# Altium schematic sheet pca10156_sheet6_power_supply.SchDoc: =BoardTitle+' - Power Supply'
size A3; Organization: Nordic Semiconductor; DocumentNumber: 6; SheetNumber: 6; SheetTotal: 8; CompanyName: Nordic Semiconductor; DocumentSize: A4
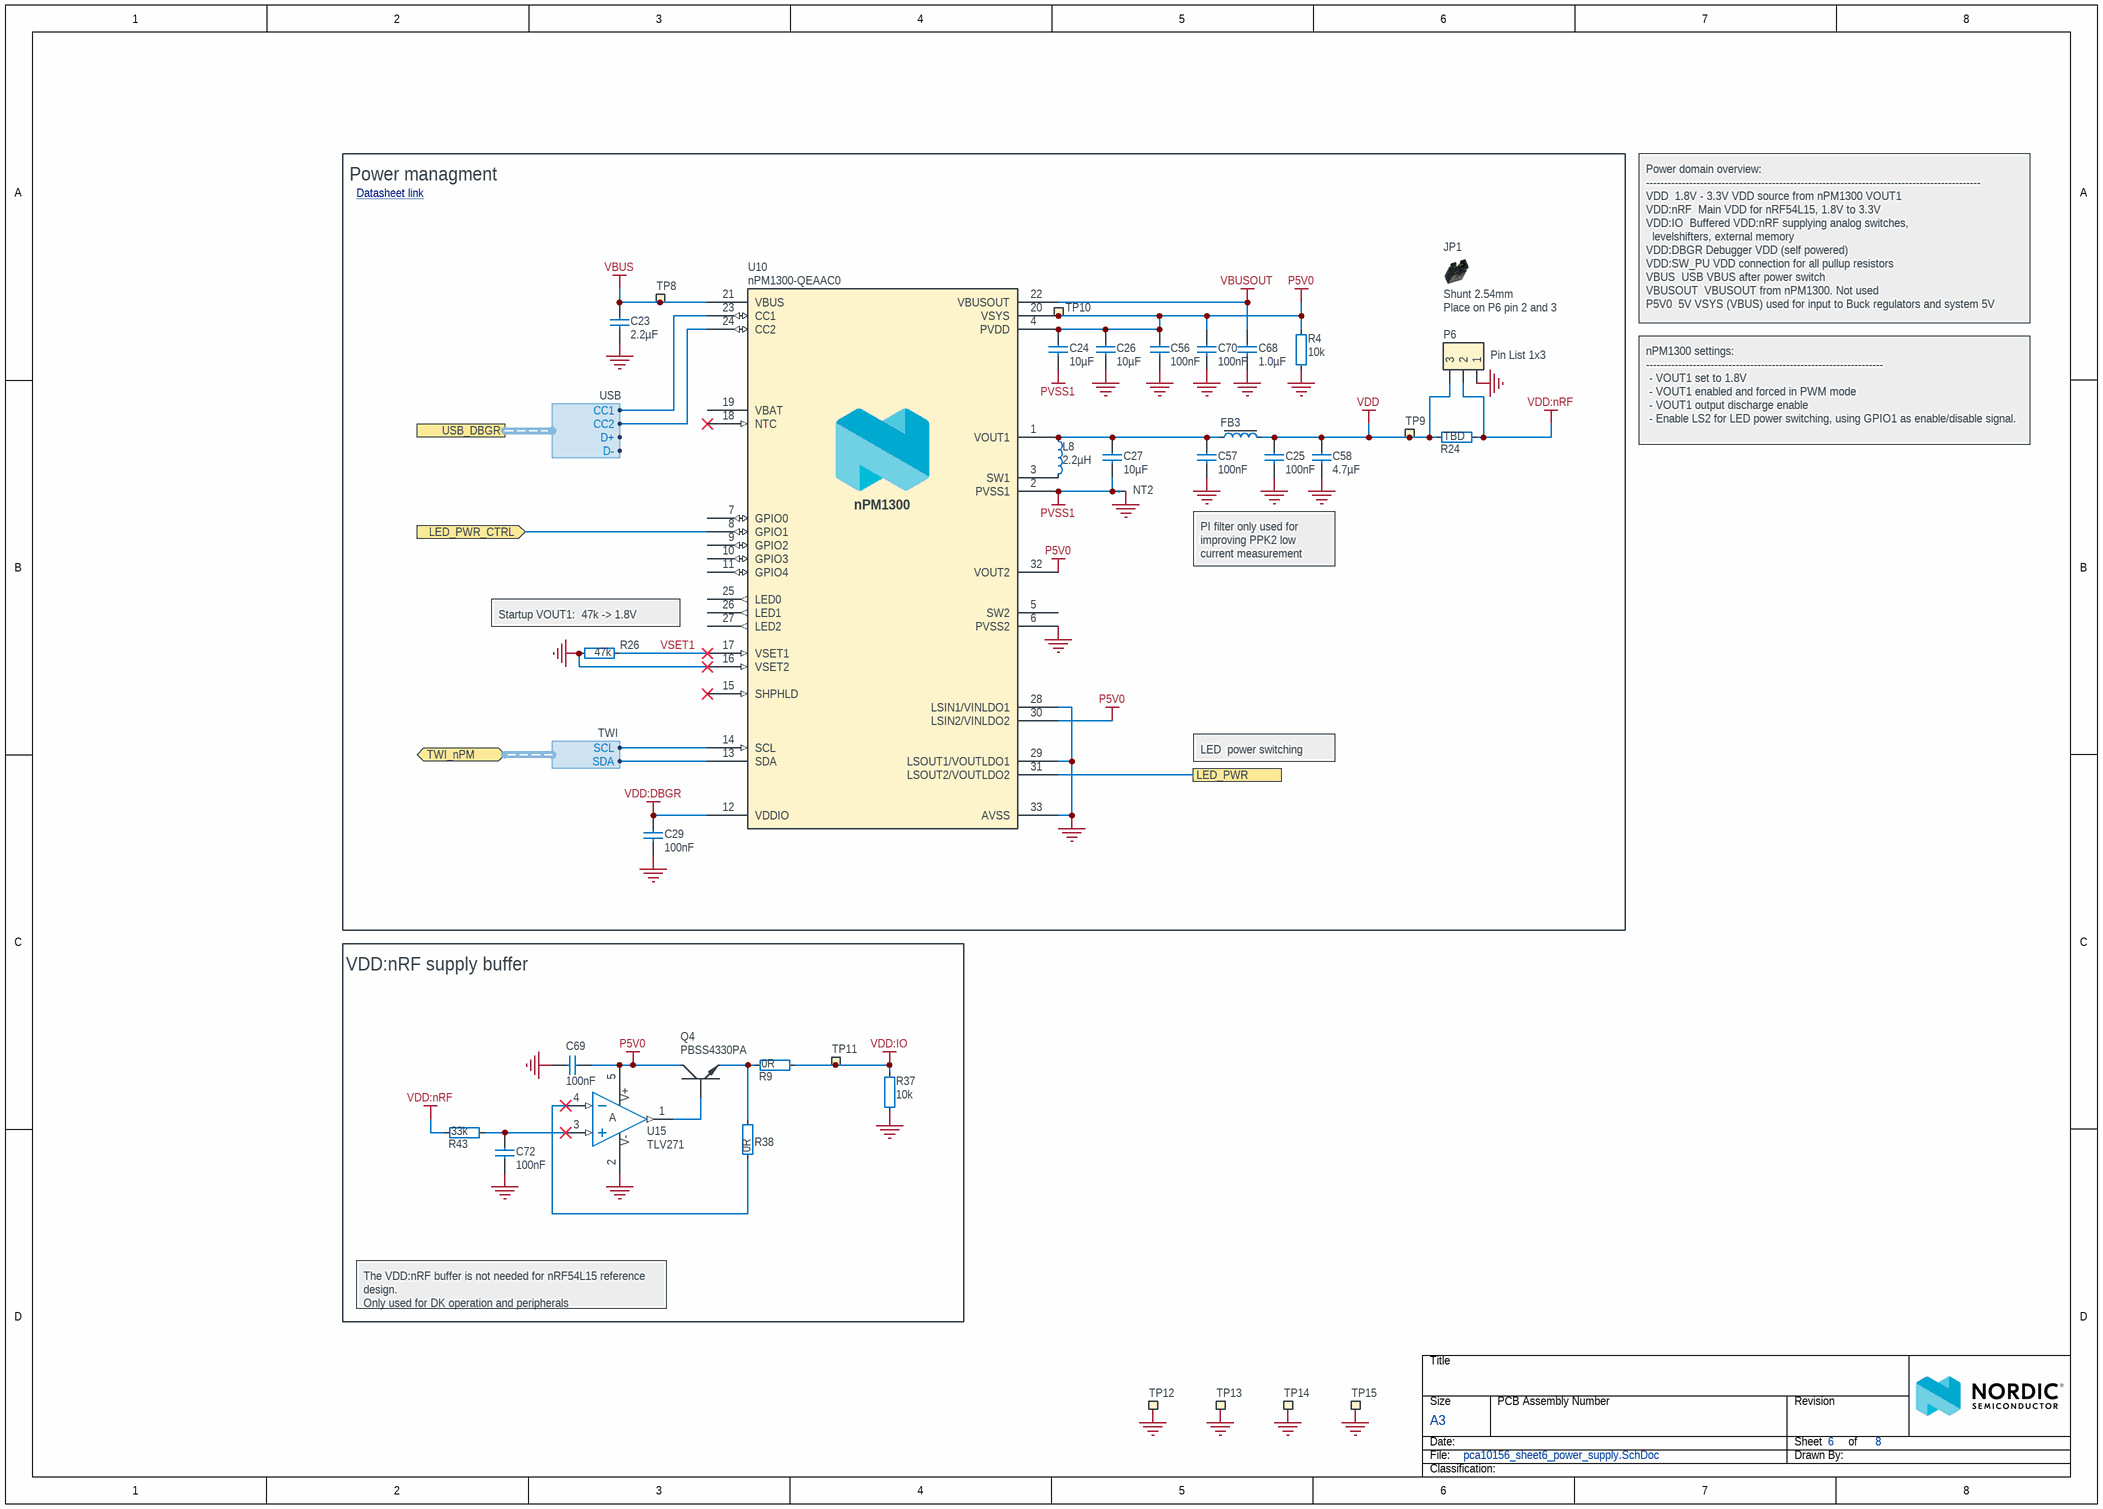
[diagram p0: pca10156_sheet6_power_supply.SchDoc]

## Parts
C23  2.2µF  [CAPC1005X04L]
C24  10µF  [CAPC1608X06L]
C25  100nF  [CAPC0603X03L_C]
C26  10µF  [CAPC1608X06L]
C27  10µF  [CAPC1608X06L]
C29  100nF  [CAPC0603X03L_C]
C56  100nF  [CAPC0603X03L_C]
C57  100nF  [CAPC0603X03L_C]
C58  4.7µF  [CAPC1608X06L]
C68  1.0µF  [CAPC1005X04L]
C69  100nF  [CAPC0603X03L_C]
C70  100nF  [CAPC0603X03L_C]
C72  100nF  [CAPC0603X03L_C]
FB3  120R/0.55A  [INDC1005X04L]  (value not drawn)
JP1  Shunt 2.54mm  Assembly: Place on P6 pin 2 and 3  [Shunt_2.54mm_Vertical]
L8  2.2µH  [INDC2016X10N]
NT2  Net tie  [2 PIN STARPOINT]  (value not drawn)  (net tie, no BOM)
P6  Pin List 1x3  [LIST_1x3_SMD]
Q4  PBSS4330PA  [DFN105P200X65-3N_v2]
R4  10k  [RESC0603X03L_C]
R9  0R  [RESC0603X03L_C]
R24  TBD  [RESC1005X04L]
R26  47k  [RESC0603X03L_C]
R37  10k  [RESC0603X03L_C]
R38  0R  [RESC0603X03L_C]
R43  33k  [RESC0603X03L_C]
TP8  Ø1.5mm,SMD  [TP_SMD_D1.5mm]  (value not drawn)  (no BOM)
TP9  Ø1.5mm,SMD  [TP_SMD_D1.5mm]  (value not drawn)  (no BOM)
TP10  Ø1.5mm,SMD  [TP_SMD_D1.5mm]  (value not drawn)  (no BOM)
TP11  Ø1.5mm,SMD  [TP_SMD_D1.5mm]  (value not drawn)  (no BOM)
TP12  Ø1.5mm,SMD  [TP_SMD_D1.5mm]  (value not drawn)  (no BOM)
TP13  Ø1.5mm,SMD  [TP_SMD_D1.5mm]  (value not drawn)  (no BOM)
TP14  Ø1.5mm,SMD  [TP_SMD_D1.5mm]  (value not drawn)  (no BOM)
TP15  Ø1.5mm,SMD  [TP_SMD_D1.5mm]  (value not drawn)  (no BOM)
U10  nPM1300-QEAAC0  [Nordic_QFN50P500X500X90-33N]
U15  TLV271  [SOT95P280X145-5N]

## Blocks framed on the sheet
Power managment: C23-C27 C29 C56-C58 C68 C70 FB3 JP1 L8 NT2 P6 R4 R24 R26 TP8-TP10 U10
VDD:nRF supply buffer: C69 C72 Q4 R9 R37 R38 R43 TP11 U15

## Ports
LED_PWR, LED_PWR_CTRL (in), TWI_nPM (bidir, harness TWI), USB_DBGR (harness USB)

## Harnesses
TWI: SDA, SCL
USB: D+, D-, CC1, CC2

## Nets
GND: C23.1 C25.1 C26.1 C29.2 C56.1 C57.1 C58.2 C68.1 C69.2 C70.1 C72.2 NT2.1 P6.1 R4.1 R26.2 R37.1 TP12.1 TP13.1 TP14.1 TP15.1 U10.6(PVSS2) U10.16(VSET2) U10.28(LSIN1/VINLDO1) U10.29(LSOUT1/VOUTLDO1) U10.33(AVSS) U15.2(VSS)
P5V0: C24.2 C26.2 C56.2 C69.1 C70.2 Q4.3(C) R4.2 TP10.1 U10.4(PVDD) U10.20(VSYS) U10.30(LSIN2/VINLDO2) U10.32(VOUT2) U15.5(VDD)
PVSS1: C24.1 C27.1 NT2.2 U10.2(PVSS1)
VBUS: C23.2 TP8.1 U10.21(VBUS)
VBUSOUT: C68.2 U10.22(VBUSOUT)
VDD: C25.2 C58.1 FB3.2 P6.3 R24.2 TP9.1
VDD:DBGR: C29.1 U10.12(VDDIO)
VDD:IO: R9.2 R37.2 TP11.1
VDD:nRF: P6.2 R24.1 R43.1
LED_PWR: U10.31(LSOUT2/VOUTLDO2) ; port LED_PWR
LED_PWR_CTRL: U10.8(GPIO1) ; port LED_PWR_CTRL
VSET1: R26.1 U10.17(VSET1)
NetC27_2: C27.2 C57.2 FB3.1 L8.1 U10.1(VOUT1)
NetC72_1: C72.1 R43.2 U15.3(IN+)
NetL8_2: L8.2 U10.3(SW1)
NetQ4_1: Q4.1(B) U15.1(OUT)
NetQ4_2: Q4.2(E) R9.1 R38.2
NetR38_1: R38.1 U15.4(IN-)
NetU10_13: U10.13(SDA) ; port TWI_nPM.SDA
NetU10_14: U10.14(SCL) ; port TWI_nPM.SCL
NetU10_23: U10.23(CC1) ; port USB_DBGR.CC1
NetU10_24: U10.24(CC2) ; port USB_DBGR.CC2

Not connected (* = marked no-connect by the designer): U10 5(SW2) 7(GPIO0) 9(GPIO2) 10(GPIO3) 11(GPIO4) 15(SHPHLD)* 18(NTC)* 19(VBAT) 25(LED0) 26(LED1) 27(LED2)

## Notes on the sheet
- Datasheet link <https://www.nordicsemi.com/Products/nPM1300>
- Power domain overview:
  ---------------------------------------------------------------------------------------------
  VDD		1.8V - 3.3V VDD source from nPM1300 VOUT1
  VDD:nRF		Main VDD for nRF54L15, 1.8V to 3.3V
  VDD:IO		Buffered VDD:nRF supplying analog switches,
  levelshifters, external memory
  VDD:DBGR	Debugger VDD (self powered)
  VDD:SW_PU	VDD connection for all pullup resistors
  VBUS		USB VBUS after power switch
  VBUSOUT		VBUSOUT from nPM1300. Not used
  P5V0		5V VSYS (VBUS) used for input to Buck regulators and system 5V
- nPM1300 settings:
  ------------------------------------------------------------------
  - VOUT1 set to 1.8V
  - VOUT1 enabled and forced in PWM mode
  - VOUT1 output discharge enable
  - Enable LS2 for LED power switching, using GPIO1 as enable/disable signal.
- PI filter only used for improving PPK2 low current measurement accuracy
- (near R26) Startup VOUT1:  47k -> 1.8V
- LED  power switching
- The VDD:nRF buffer is not needed for nRF54L15 reference design.
  Only used for DK operation and peripherals
- Title
- Size
- Date:
- File:
- A3
- PCB Assembly Number
- Sheet
- Drawn By:
- Revision
- of
- Classification:
- (in symbol nPM1300-QEAAC0) nPM1300
- (in symbol TLV271CW5-7) V+; A; V-

## Library data of the parts
C23 = C0402-2µ2-10V: Capacitor, X5R, ±10%; Manufacturer: N.A.; Part number NEMS: 100200376; Component Status: Active; Pad Count: 2; Note: 10V; Part Number: C0402-2µ2-10V; PartId: 100200376; Component Class: Capacitors; Author: rsk; Manufacturer Part Number: N.A.; ComponentLink1URL: N.A.; ComponentLink1Description: Datasheet; ComponentLink2URL: N.A.; ComponentLink2Description: Supplier link; HelpURL: N.A.; LatestRevisionDate: 2020-10-13; Published: 2016-08-22; Footprint Doc: 0402; Value: 2.2µF; Supplier 1: Digi-Key; Supplier Part Number 1: 490-10451-1-ND; Supplier 2: N.A.; Supplier Part Number 2: N.A.; Artikkelnr Noca: N.A.; Part number IPS: N.A.; Part number Norautron: N.A.
C24 C26 C27 = C0603-10µ-10V-X7T-GRM188D71A106MA73: Capacitor, X7T, ±20%, 10V; Manufacturer: Murata; Part number IPS: 00000004696; Part number NEMS: 100200414; Component Status: Active; Pad Count: 2; Note: 10VDC; Artikkelnr Noca: N.A.; Part Number: C0603-10µ-10V-X7T-GRM188D71A106MA73; PartId: 100200414; Component Class: Capacitors; Author: rsk; Manufacturer Part Number: GRM188D71A106MA73; ComponentLink1URL: N.A.; ComponentLink1Description: Datasheet; ComponentLink2URL: N.A.; ComponentLink2Description: Supplier link; HelpURL: https://no.mouser.com/datasheet/2/281/murata_03052018_GRM_Series_1-1310166.pdf; LatestRevisionDate: 2021-07-22; Published: 2018-09-11; Footprint Doc: 0603; Value: 10µF; Supplier 1: Digi-Key; Supplier Part Number 1: 490-7200-1-ND; Supplier 2: Mouser; Supplier Part Number 2: 81-GRM188D71A106MA3D; Part number Norautron: N.A.
C25 C56 C57 C70 = C0201-100n: Capacitor, X5R, ±10%; Manufacturer: N.A.; Part number IPS: 00000001248, 00000002505; Part number Norautron: 262071862; Part number NEMS: 100200078; Note: 16V; Pad Count: 2; Component Status: Active; Part Number: C0201-100n; Manufacturer Part Number: N.A.; LatestRevisionDate: 2017-11-09; Published: 2014-11-13; Value: 100nF; Artikkelnr Noca: N.A.; Footprint Doc: 0201; ComponentLink1URL: N.A.; ComponentLink1Description: Datasheet; ComponentLink2URL: N.A.; ComponentLink2Description: Supplier link; HelpURL: N.A.; Supplier 1: N.A.; Supplier Part Number 1: N.A.; Supplier 2: N.A.; Supplier Part Number 2: N.A.; Component Class: Capacitors; PartId: 100200078; Author: rsk
C29 C69 C72 = C0201-100n: Capacitor, X5R, ±10%; Manufacturer: N.A.; Part number IPS: 00000001248, 00000002505; Part number Norautron: 262071862; Part number NEMS: 100200078; Pad Count: 2; Note: 16V; Component Status: Active; Part Number: C0201-100n; Value: 100nF; Footprint Doc: 0201; Component Class: Capacitors; Author: rsk; PartId: 100200078; Manufacturer Part Number: N.A.; ComponentLink1URL: N.A.; ComponentLink1Description: Datasheet; ComponentLink2URL: N.A.; ComponentLink2Description: Supplier link; HelpURL: N.A.; LatestRevisionDate: 2017-11-09; Published: 2014-11-13; Supplier 1: N.A.; Supplier Part Number 1: N.A.; Supplier 2: N.A.; Supplier Part Number 2: N.A.; Artikkelnr Noca: N.A.
C58 = C0603-4µ7-10V-X7S: Capacitor, X7S, ±10%, 10V; Manufacturer: N.A.; Part number IPS: 00000001779; Part number NEMS: 100200351; Pad Count: 2; Artikkelnr Noca: 20030013; Component Status: Active; Part Number: C0603-4µ7-10V-X7S; Value: 4.7µF; Footprint Doc: 0603; Component Class: Capacitors; Author: rsk; PartId: 100200351; Manufacturer Part Number: N.A.; ComponentLink1URL: N.A.; ComponentLink1Description: Datasheet; ComponentLink2URL: N.A.; ComponentLink2Description: Supplier link; HelpURL: N.A.; LatestRevisionDate: 2016-08-15; Published: 2016-08-15; Note: 10V; Supplier 1: Digi-Key; Supplier Part Number 1: 445-14258-1-ND; Supplier 2: N.A.; Supplier Part Number 2: N.A.; Part number Norautron: N.A.
C68 = C0402-1µ0-6.3V-X5R-10%: Capacitor, X5R, ±10%, 6.3V; Manufacturer: N.A.; Part number Norautron: 26207137; Part number NEMS: 100200498; Pad Count: 2; Component Status: Active; Part Number: C0402-1µ0-6.3V-X5R-10%; Manufacturer Part Number: N.A.; LatestRevisionDate: 2022-01-27; Published: 2022-01-27; Value: 1.0µF; Note: 6.3V; Artikkelnr Noca: N.A.; Footprint Doc: 0402; ComponentLink1URL: N.A.; ComponentLink1Description: Datasheet; ComponentLink2URL: N.A.; ComponentLink2Description: Supplier link; HelpURL: N.A.; Supplier 1: N.A.; Supplier Part Number 1: N.A.; Supplier 2: N.A.; Supplier Part Number 2: N.A.; Part number IPS: N.A.; Component Class: Capacitors; PartId: 100200498; Author: rubr
FB3 = FB0402-120R@100M-500mA: Ferrite Bead, 120 Ohm @ 100MHz, 500mA, 250 mOhm Max; Manufacturer: Murata; Manufacturer Part Number: BLM15AG121SN1D; Part number IPS: 00000009954; Part number Norautron: 265230631; Part number NEMS: 100300099; Note: Chip EMIFIL Inductor Type Chip Ferrite Bead; Artikkelnr Noca: 33029317; Pad Count: 2; Component Status: Active; Part Number: FB0402-120R@100M-500mA; Footprint Doc: 0402; LatestRevisionDate: 2014-01-10; Published: 2011-11-14; Value: 120R/0.55A; ComponentLink1Description: Datasheet; ComponentLink2Description: Supplier link; ComponentLink1URL: N.A.; ComponentLink2URL: N.A.; HelpURL: http://search.murata.co.jp/Ceramy/image/img/PDF/ENG/L0110S0100BLM15A_SN.pdf; Supplier 1: Digi-Key; Supplier Part Number 1: 490-1005-1-ND; Supplier 2: Farnell; Supplier Part Number 2: 151-5760; Component Class: Inductors; PartId: 100300099; Author: rsk
JP1 = SHUNT JUMPER 2.54mm Black Vertical: Shunt Jumper 2.54mm Black, open top; Manufacturer: WCON; Manufacturer Part Number: 3710-6001OS0B05; Part number NEMS: 100500728; Pad Count: 2; Note: N.A.; Component Status: Active; System: Connector; Part Number: SHUNT JUMPER 2.54mm Black Vertical; PartId: 100500752; Component Class: Connectors; Author: masi; ComponentLink1URL: N.A.; ComponentLink1Description: Datasheet; ComponentLink2URL: N.A.; ComponentLink2Description: Supplier link; HelpURL: N.A.; Footprint Doc: SHUNT JUMPER 2.54mm; LatestRevisionDate: 2024-08-02; Published: 2022-07-01; Value: Shunt 2.54mm; Supplier 1: Cabcon; Supplier Part Number 1: 3710-6001OS0B05; Supplier 2: N.A.; Supplier Part Number 2: N.A.; Artikkelnr Noca: N.A.; Part number IPS: N.A.; Part number Norautron: N.A.
L8 = L0806-2µ2-2500mA-73mOhm-CIGT201610EH2R2MNE: Inductor, Irms=2.5A, Isat=2.9A, ±20%, DCR=73mΩ; Manufacturer: Samsung Electro-Mechanics America; Part number Norautron: 26521789; Part number NEMS: 100300400; Component Status: Active; Pad Count: 2; Note: Unshielded Thin Film Inductor; Artikkelnr Noca: N.A.; Part Number: L0806-2µ2-2500mA-73mOhm-CIGT201610EH2R2MNE; PartId: 100300400; Component Class: Inductors; Author: rsk; Manufacturer Part Number: CIGT201610EH2R2MNE; ComponentLink1URL: https://media.digikey.com/pdf/Data%20Sheets/Samsung%20PDFs/CIGT201610EH2R2MNE_Spec.pdf; ComponentLink1Description: Datasheet; ComponentLink2URL: https://www.digikey.com/en/products/detail/samsung-electro-mechanics/CIGT201610EH2R2MNE/7041223?s=N4IgTCBcDaIMIEkDiAVMAGAjANk%2BgogBJgBKYAsgHL4gC6AvkA; ComponentLink2Description: Supplier link; HelpURL: http://product.samsungsem.com/pi/CIGT201610EH2R2MN.do; LatestRevisionDate: 2022-09-07; Published: 2021-02-03; Footprint Doc: 0806; Value: 2.2µH; Supplier 1: Digi-Key; Supplier Part Number 1: 1276-6901-1-ND; Supplier 2: Mouser; Supplier Part Number 2: 187-CIGT201610EH2R2M; Part number IPS: N.A.
NT2 = 2 pin starpoint: Starpoint; Manufacturer: N.A.; Part number NEMS: 100500603; Pad Count: 2; Component Status: Active; System: Connector; Part Number: 2 pin starpoint; Manufacturer Part Number: N.A.; ComponentLink1URL: N.A.; ComponentLink1Description: Datasheet; ComponentLink2URL: N.A.; ComponentLink2Description: Supplier link; HelpURL: N.A.; Footprint Doc: N.A.; LatestRevisionDate: 2017-08-31; Published: 2017-08-31; Value: Net tie; Note: Net tie; Supplier 1: N.A.; Supplier Part Number 1: N.A.; Supplier 2: N.A.; Supplier Part Number 2: N.A.; Artikkelnr Noca: N.A.; Part number IPS: N.A.; Component Class: Connectors; PartId: 100500603; Author: rsk; Part number Norautron: N.A.
P6 = Pin List 1x3 SMD: Pin List 1x3, 2.54mm (100mil), SMD; Manufacturer: WCON; Manufacturer Part Number: 1125-1103S0M116CR04; Part number Norautron: 26470016; Part number NEMS: 100500306; Note: N.A.; Pad Count: 3; Component Status: Active; System: Connector; Part Number: Pin List 1x3 SMD; Footprint Doc: LIST_1x3_SMD; LatestRevisionDate: 2021-09-24; Published: 2013-10-21; Value: Pin List 1x3; Artikkelnr Noca: N.A.; ComponentLink1URL: N.A.; ComponentLink1Description: Datasheet; ComponentLink2URL: N.A.; ComponentLink2Description: Supplier link; HelpURL: N.A.; Part number IPS: N.A.; Supplier 1: Cabcon; Supplier Part Number 1: 1125-1103S0M116CR04; Supplier 2: Samtec; Supplier Part Number 2: TSM-103-01-L-SV-P-TR; Component Class: Connectors; PartId: 100500306; Author: rsk
Q4 = PBSS4330PA,115: 30V, 3A, 2.1W, G=270, NPN Transistor; Manufacturer: Nexperia; Part number NEMS: 101300184; Component Status: Active; Pad Count: 3; Note: N.A.; Part Number: PBSS4330PA,115; PartId: 101300184; Component Class: Semiconductors; Author: rubr; Manufacturer Part Number: PBSS4330PA,115; ComponentLink1URL: https://assets.nexperia.com/documents/data-sheet/PBSS4330PA.pdf; ComponentLink1Description: Datasheet; ComponentLink2URL: https://www.digikey.com/en/products/detail/nexperia-usa-inc/PBSS4330PA-115/2296330; ComponentLink2Description: Supplier link; HelpURL: https://www.nexperia.com/products/bipolar-transistors/general-purpose-and-low-vcesat-bipolar-transistors/single-bipolar-transistors/single-bipolar-transistors-100-v/PBSS4330PA.html; LatestRevisionDate: 2021-06-03; Published: 2021-06-03; Footprint Doc: HUSON-3 (2x2); Value: PBSS4330PA; Supplier 1: Digi-Key; Supplier Part Number 1: 1727-5112-1-ND‎; Supplier 2: N.A.; Supplier Part Number 2: N.A.; Artikkelnr Noca: N.A.; Part number IPS: N.A.; Part number Norautron: N.A.
R4 R37 = R0201-10k: Resistor, ±1%, 0.05W; Manufacturer: N.A.; Part number IPS: 00000001255; Part number Norautron: 26107101; Part number NEMS: 100100065; Component Status: Active; Pad Count: 2; Note: Chip Res 1%; Part Number: R0201-10k; PartId: 100100065; Component Class: Resistors; Author: rsk; Manufacturer Part Number: N.A.; ComponentLink1URL: N.A.; ComponentLink1Description: Datasheet; ComponentLink2URL: N.A.; ComponentLink2Description: Supplier link; HelpURL: N.A.; LatestRevisionDate: 2014-11-13; Published: 2014-11-13; Footprint Doc: 0201; Value: 10k; Supplier 1: N.A.; Supplier Part Number 1: N.A.; Supplier 2: N.A.; Supplier Part Number 2: N.A.; Artikkelnr Noca: N.A.
R9 R38 = R0201-0R: Resistor, ±5%, 0.05W; Manufacturer: N.A.; Part number IPS: 00000003245; Part number NEMS: 100100001; Component Status: Active; Pad Count: 2; Note: Chip Res 5%; Part Number: R0201-0R; PartId: 100100001; Component Class: Resistors; Author: rsk; Manufacturer Part Number: N.A.; ComponentLink1URL: N.A.; ComponentLink1Description: Datasheet; ComponentLink2URL: N.A.; ComponentLink2Description: Supplier link; HelpURL: N.A.; LatestRevisionDate: 2017-11-09; Published: 2014-11-13; Footprint Doc: 0201; Value: 0R; Supplier 1: N.A.; Supplier Part Number 1: N.A.; Supplier 2: N.A.; Supplier Part Number 2: N.A.; Artikkelnr Noca: N.A.; Part number Norautron: N.A.
R24 = R0402-TBD: Chip Res 0402; Manufacturer: N.A.; Part number NEMS: 100100282; Component Status: Active; Pad Count: 2; Part Number: R0402-TBD; PartId: 100100282; Component Class: Resistors; Author: rsk; Manufacturer Part Number: N.A.; ComponentLink1URL: N.A.; ComponentLink1Description: Datasheet; ComponentLink2URL: N.A.; ComponentLink2Description: Supplier link; HelpURL: N.A.; LatestRevisionDate: 2010-12-21; Published: 2010-12-21; Footprint Doc: 0402; Value: TBD; Note: Chip Res; Supplier 1: N.A.; Supplier Part Number 1: N.A.; Supplier 2: N.A.; Supplier Part Number 2: N.A.; Artikkelnr Noca: N.A.; Part number IPS: N.A.; Part number Norautron: N.A.
R26 = R0201-47k: Resistor, ±1%, 0.05W; Manufacturer: N.A.; Part number IPS: 00000001423; Part number NEMS: 100100076; Component Status: Active; Pad Count: 2; Note: Chip Res 1%; Part Number: R0201-47k; PartId: 100100076; Component Class: Resistors; Author: rsk; Manufacturer Part Number: N.A.; ComponentLink1URL: N.A.; ComponentLink1Description: Datasheet; ComponentLink2URL: N.A.; ComponentLink2Description: Supplier link; HelpURL: N.A.; LatestRevisionDate: 2014-11-13; Published: 2014-11-13; Footprint Doc: 0201; Value: 47k; Supplier 1: N.A.; Supplier Part Number 1: N.A.; Supplier 2: N.A.; Supplier Part Number 2: N.A.; Artikkelnr Noca: N.A.; Part number Norautron: N.A.
R43 = R0201-33k: Resistor, ±1%, 0.05W; Manufacturer: N.A.; Part number IPS: 00000001708; Part number NEMS: 100100073; Component Status: Active; Pad Count: 2; Note: Chip Res 1%; Part Number: R0201-33k; PartId: 100100073; Component Class: Resistors; Author: rsk; Manufacturer Part Number: N.A.; ComponentLink1URL: N.A.; ComponentLink1Description: Datasheet; ComponentLink2URL: N.A.; ComponentLink2Description: Supplier link; HelpURL: N.A.; LatestRevisionDate: 2014-11-13; Published: 2014-11-13; Footprint Doc: 0201; Value: 33k; Supplier 1: N.A.; Supplier Part Number 1: N.A.; Supplier 2: N.A.; Supplier Part Number 2: N.A.; Artikkelnr Noca: N.A.; Part number Norautron: N.A.
TP8-TP15 = TP_SMD_Ø1.5MM: 1.5mm circular SMD testpad; Manufacturer: Nordic Semiconductor; Manufacturer Part Number: N.A.; Part number NEMS: 100500477; Pad Count: 1; Component Status: Active; Part Number: TP_SMD_Ø1.5MM; ComponentLink1URL: N.A.; ComponentLink1Description: Datasheet; ComponentLink2URL: N.A.; ComponentLink2Description: Supplier link; HelpURL: N.A.; Footprint Doc: TP_SMD_Ø1.5mm; LatestRevisionDate: 2021-03-05; Published: 2016-06-02; Value: Ø1.5mm,SMD; Note: N.A.; Supplier 1: N.A.; Supplier Part Number 1: N.A.; Supplier 2: N.A.; Supplier Part Number 2: N.A.; Artikkelnr Noca: N.A.; Part number IPS: N.A.; Component Class: Connectors; PartId: 100500477; Author: rsk; Part number Norautron: N.A.
U10 = nPM1300-QEAAC0: Li-Ion/Li-Polymer USB-C battery charger with high efficiency buck regulators, LDOs or load switches, LED drivers, TWI and VBUSOUT; Manufacturer: Nordic Semiconductor; Part number NEMS: 102000306; Component Status: Active; Pad Count: 33; Note: Production version; Artikkelnr Noca: N.A.; Part Number: nPM1300-QEAAC0; PartId: 102000306; Component Class: Nordic_Devices; Author: eisk; Manufacturer Part Number: nPM1300-QEAAC0; ComponentLink1URL: N.A.; ComponentLink1Description: Datasheet; ComponentLink2URL: N.A.; ComponentLink2Description: Supplier link; HelpURL: N.A.; LatestRevisionDate: 2023-08-16; Published: 2023-08-16; Footprint Doc: QFN-32; Value: nPM1300-QEAAC0; Supplier 1: Nordic Semiconductor; Supplier Part Number 1: nPM1300-QEAAC0; Supplier 2: N.A.; Supplier Part Number 2: N.A.; Part number IPS: N.A.; Part number Norautron: N.A.
U15 = TLV271CW5-7: Dual rail to rail CMOS Amplifier; Manufacturer: Diodes Incorporated; Part number NEMS: 101900398; Component Status: Active; Pad Count: 5; Note: N.A.; Part Number: TLV271CW5-7; PartId: 101900398; Component Class: Misc_ICs; Author: rsk; Manufacturer Part Number: TLV271CW5-7; ComponentLink1URL: N.A.; ComponentLink1Description: Datasheet; ComponentLink2URL: N.A.; ComponentLink2Description: Supplier link; HelpURL: http://www.diodes.com/_files/datasheets/TLV27x.pdf; LatestRevisionDate: 2016-04-05; Published: 2016-04-05; Footprint Doc: SOT-25; Value: TLV271; Supplier 1: Digi-Key; Supplier Part Number 1: TLV271CW5-7DICT-ND; Supplier 2: N.A.; Supplier Part Number 2: N.A.; Artikkelnr Noca: N.A.; Part number IPS: N.A.; Part number Norautron: N.A.